# Altium schematic sheet AD_0.SchDoc
size A2; Date: Date; CompanyName: HESSO; Engineer: Name; Address1: Route du Rawyl 47; Address2: 1950 Sion; Address3: Switzerland; DocumentNumber: 5; SheetNumber: 5; SheetTotal: 8; ProjectName: Project Name
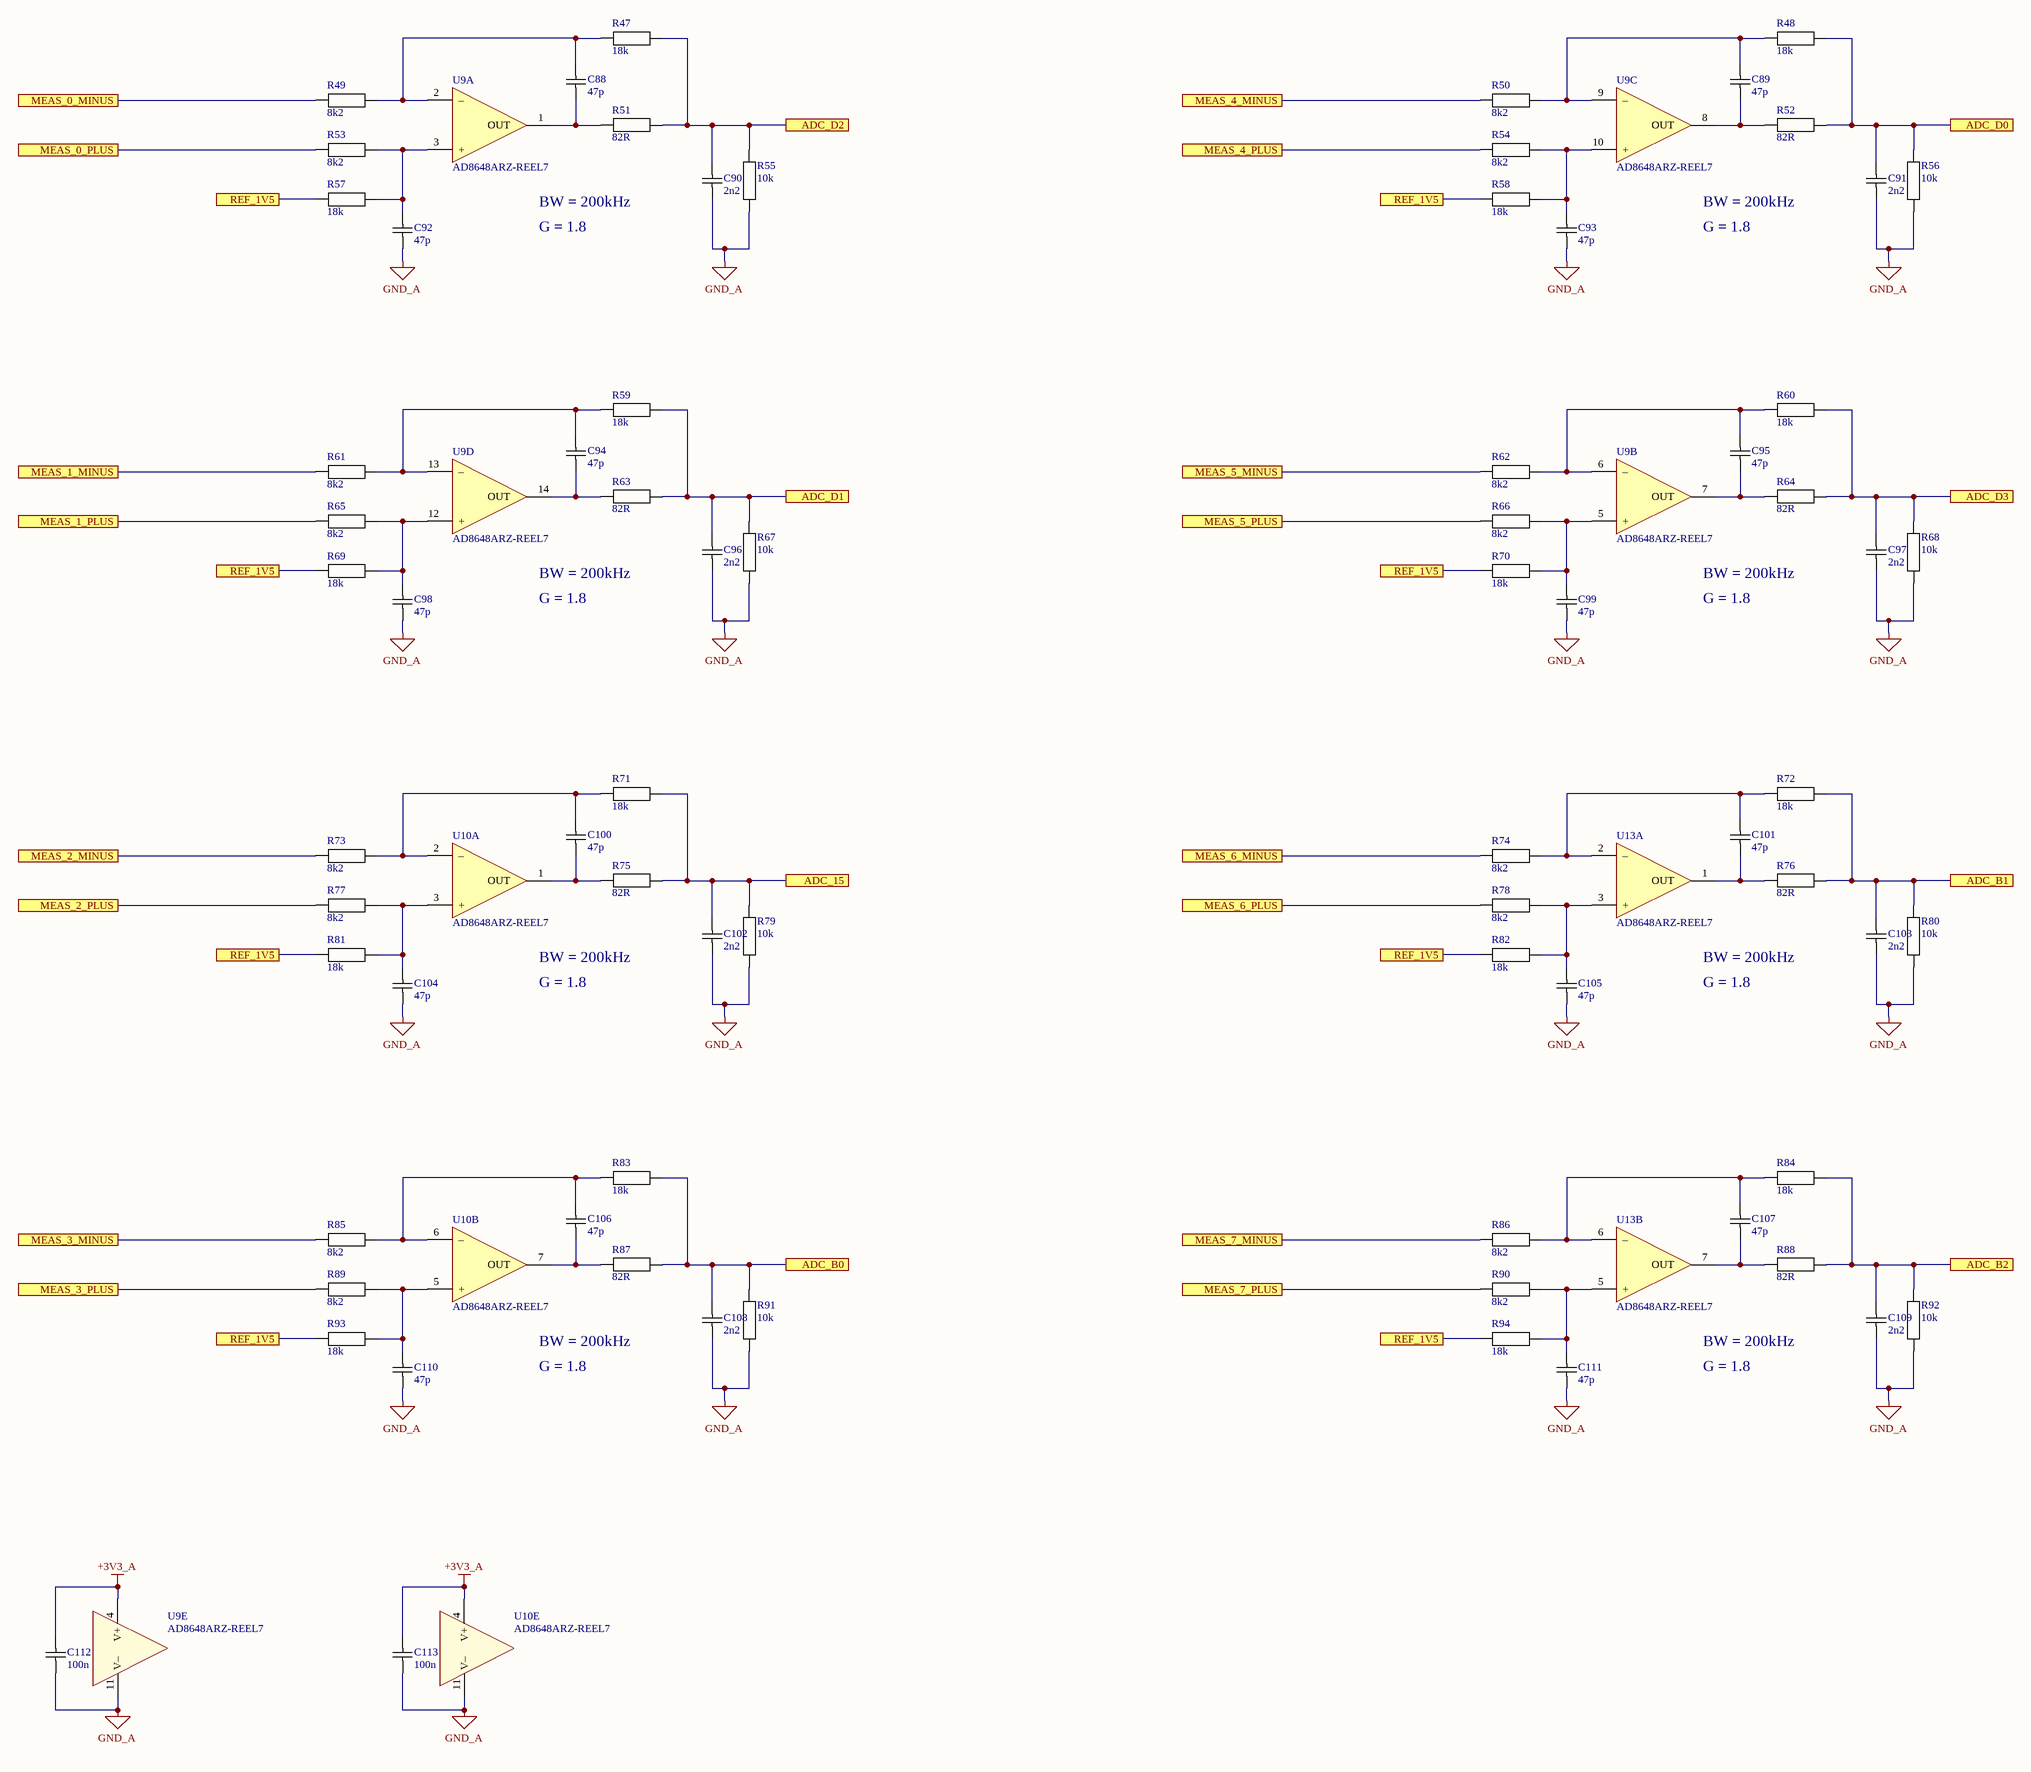
[diagram p0: AD_0.SchDoc]

## Parts
C88  47p  [CAPACITOR 1608 REFLOW]
C89  47p  [CAPACITOR 1608 REFLOW]
C90  2n2  [CAPACITOR 1608 REFLOW]
C91  2n2  [CAPACITOR 1608 REFLOW]
C92  47p  [CAPACITOR 1608 REFLOW]
C93  47p  [CAPACITOR 1608 REFLOW]
C94  47p  [CAPACITOR 1608 REFLOW]
C95  47p  [CAPACITOR 1608 REFLOW]
C96  2n2  [CAPACITOR 1608 REFLOW]
C97  2n2  [CAPACITOR 1608 REFLOW]
C98  47p  [CAPACITOR 1608 REFLOW]
C99  47p  [CAPACITOR 1608 REFLOW]
C100  47p  [CAPACITOR 1608 REFLOW]
C101  47p  [CAPACITOR 1608 REFLOW]
C102  2n2  [CAPACITOR 1608 REFLOW]
C103  2n2  [CAPACITOR 1608 REFLOW]
C104  47p  [CAPACITOR 1608 REFLOW]
C105  47p  [CAPACITOR 1608 REFLOW]
C106  47p  [CAPACITOR 1608 REFLOW]
C107  47p  [CAPACITOR 1608 REFLOW]
C108  2n2  [CAPACITOR 1608 REFLOW]
C109  2n2  [CAPACITOR 1608 REFLOW]
C110  47p  [CAPACITOR 1608 REFLOW]
C111  47p  [CAPACITOR 1608 REFLOW]
C112  100n  [CAPACITOR 1608 REFLOW]
C113  100n  [CAPACITOR 1608 REFLOW]
R47  18k  [RESISTOR 1608 REFLOW]
R48  18k  [RESISTOR 1608 REFLOW]
R49  8k2  [RESISTOR 1608 REFLOW]
R50  8k2  [RESISTOR 1608 REFLOW]
R51  82R  [RESISTOR 1608 REFLOW]
R52  82R  [RESISTOR 1608 REFLOW]
R53  8k2  [RESISTOR 1608 REFLOW]
R54  8k2  [RESISTOR 1608 REFLOW]
R55  10k  [RESISTOR 1608 REFLOW]
R56  10k  [RESISTOR 1608 REFLOW]
R57  18k  [RESISTOR 1608 REFLOW]
R58  18k  [RESISTOR 1608 REFLOW]
R59  18k  [RESISTOR 1608 REFLOW]
R60  18k  [RESISTOR 1608 REFLOW]
R61  8k2  [RESISTOR 1608 REFLOW]
R62  8k2  [RESISTOR 1608 REFLOW]
R63  82R  [RESISTOR 1608 REFLOW]
R64  82R  [RESISTOR 1608 REFLOW]
R65  8k2  [RESISTOR 1608 REFLOW]
R66  8k2  [RESISTOR 1608 REFLOW]
R67  10k  [RESISTOR 1608 REFLOW]
R68  10k  [RESISTOR 1608 REFLOW]
R69  18k  [RESISTOR 1608 REFLOW]
R70  18k  [RESISTOR 1608 REFLOW]
R71  18k  [RESISTOR 1608 REFLOW]
R72  18k  [RESISTOR 1608 REFLOW]
R73  8k2  [RESISTOR 1608 REFLOW]
R74  8k2  [RESISTOR 1608 REFLOW]
R75  82R  [RESISTOR 1608 REFLOW]
R76  82R  [RESISTOR 1608 REFLOW]
R77  8k2  [RESISTOR 1608 REFLOW]
R78  8k2  [RESISTOR 1608 REFLOW]
R79  10k  [RESISTOR 1608 REFLOW]
R80  10k  [RESISTOR 1608 REFLOW]
R81  18k  [RESISTOR 1608 REFLOW]
R82  18k  [RESISTOR 1608 REFLOW]
R83  18k  [RESISTOR 1608 REFLOW]
R84  18k  [RESISTOR 1608 REFLOW]
R85  8k2  [RESISTOR 1608 REFLOW]
R86  8k2  [RESISTOR 1608 REFLOW]
R87  82R  [RESISTOR 1608 REFLOW]
R88  82R  [RESISTOR 1608 REFLOW]
R89  8k2  [RESISTOR 1608 REFLOW]
R90  8k2  [RESISTOR 1608 REFLOW]
R91  10k  [RESISTOR 1608 REFLOW]
R92  10k  [RESISTOR 1608 REFLOW]
R93  18k  [RESISTOR 1608 REFLOW]
R94  18k  [RESISTOR 1608 REFLOW]
U9  AD8648ARZ-REEL7  [SO14 P1.27 C4.0X8.8 H1.75]  (parts A,B,C,D,E of 5)
U10  AD8648ARZ-REEL7  [SO14 P1.27 C4.0X8.8 H1.75]  (parts A,B,E of 5)
U13  AD8648ARZ-REEL7  [SO14 P1.27 C4.0X8.8 H1.75]  (parts A,B of 5)

## Ports
ADC_15, ADC_B0, ADC_B1, ADC_B2, ADC_D0, ADC_D1, ADC_D2, ADC_D3, MEAS_0_MINUS, MEAS_0_PLUS, MEAS_1_MINUS, MEAS_1_PLUS, MEAS_2_MINUS, MEAS_2_PLUS, MEAS_3_MINUS, MEAS_3_PLUS, MEAS_4_MINUS, MEAS_4_PLUS, MEAS_5_MINUS, MEAS_5_PLUS, MEAS_6_MINUS, MEAS_6_PLUS, MEAS_7_MINUS, MEAS_7_PLUS, REF_1V5

## Nets
+3V3_A: C112.2 C113.2 U9.4(V+) U10.4(V+)
GND_A: C90.1 C91.1 C92.1 C93.1 C96.1 C97.1 C98.1 C99.1 C102.1 C103.1 C104.1 C105.1 C108.1 C109.1 C110.1 C111.1 C112.1 C113.1 R55.2 R56.2 R67.2 R68.2 R79.2 R80.2 R91.2 R92.2 U9.11(V–) U10.11(V–)
ADC_15: C102.2 R71.2 R75.2 R79.1 ; port ADC_15
ADC_B0: C108.2 R83.2 R87.2 R91.1 ; port ADC_B0
ADC_B1: C103.2 R72.2 R76.2 R80.1 ; port ADC_B1
ADC_B2: C109.2 R84.2 R88.2 R92.1 ; port ADC_B2
ADC_D0: C91.2 R48.2 R52.2 R56.1 ; port ADC_D0
ADC_D1: C96.2 R59.2 R63.2 R67.1 ; port ADC_D1
ADC_D2: C90.2 R47.2 R51.2 R55.1 ; port ADC_D2
ADC_D3: C97.2 R60.2 R64.2 R68.1 ; port ADC_D3
MEAS_0_MINUS: R49.1 ; port MEAS_0_MINUS
MEAS_0_PLUS: R53.1 ; port MEAS_0_PLUS
MEAS_1_MINUS: R61.1 ; port MEAS_1_MINUS
MEAS_1_PLUS: R65.1 ; port MEAS_1_PLUS
MEAS_2_MINUS: R73.1 ; port MEAS_2_MINUS
MEAS_2_PLUS: R77.1 ; port MEAS_2_PLUS
MEAS_3_MINUS: R85.1 ; port MEAS_3_MINUS
MEAS_3_PLUS: R89.1 ; port MEAS_3_PLUS
MEAS_4_MINUS: R50.1 ; port MEAS_4_MINUS
MEAS_4_PLUS: R54.1 ; port MEAS_4_PLUS
MEAS_5_MINUS: R62.1 ; port MEAS_5_MINUS
MEAS_5_PLUS: R66.1 ; port MEAS_5_PLUS
MEAS_6_MINUS: R74.1 ; port MEAS_6_MINUS
MEAS_6_PLUS: R78.1 ; port MEAS_6_PLUS
MEAS_7_MINUS: R86.1 ; port MEAS_7_MINUS
MEAS_7_PLUS: R90.1 ; port MEAS_7_PLUS
REF_1V5: R57.2 R58.2 R69.2 R70.2 R81.2 R82.2 R93.2 R94.2 ; port REF_1V5
NetC88_1: C88.1 R51.1 U9.1(OUT)
NetC88_2: C88.2 R47.1 R49.2 U9.2(–)
NetC89_1: C89.1 R52.1 U9.8(OUT)
NetC89_2: C89.2 R48.1 R50.2 U9.9(–)
NetC92_2: C92.2 R53.2 R57.1 U9.3(+)
NetC93_2: C93.2 R54.2 R58.1 U9.10(+)
NetC94_1: C94.1 R63.1 U9.14(OUT)
NetC94_2: C94.2 R59.1 R61.2 U9.13(–)
NetC95_1: C95.1 R64.1 U9.7(OUT)
NetC95_2: C95.2 R60.1 R62.2 U9.6(–)
NetC98_2: C98.2 R65.2 R69.1 U9.12(+)
NetC99_2: C99.2 R66.2 R70.1 U9.5(+)
NetC100_1: C100.1 R75.1 U10.1(OUT)
NetC100_2: C100.2 R71.1 R73.2 U10.2(–)
NetC101_1: C101.1 R76.1 U13.1(OUT)
NetC101_2: C101.2 R72.1 R74.2 U13.2(–)
NetC104_2: C104.2 R77.2 R81.1 U10.3(+)
NetC105_2: C105.2 R78.2 R82.1 U13.3(+)
NetC106_1: C106.1 R87.1 U10.7(OUT)
NetC106_2: C106.2 R83.1 R85.2 U10.6(–)
NetC107_1: C107.1 R88.1 U13.7(OUT)
NetC107_2: C107.2 R84.1 R86.2 U13.6(–)
NetC110_2: C110.2 R89.2 R93.1 U10.5(+)
NetC111_2: C111.2 R90.2 R94.1 U13.5(+)

## Notes on the sheet
- BW = 200kHz
- G = 1.8
- Date :
- Revision :
- Sheet
- of
- Design by :

## Library data of the parts
C88-C113 = Capacitor: Capacitor X7R 10% 50V 1608(0603)
  C88 C89 C92-C95 C98-C101 C104-C107 C110 C111: Value: 47p
  C90 C91 C96 C97 C102 C103 C108 C109: Value: 2n2
  C112 C113: Value: 100n
R47-R94 = Resistor: Resistor 1% 50V 100mW 1608(0603)
  R47 R48 R57-R60 R69-R72 R81-R84 R93 R94: Value: 18k
  R49 R50 R53 R54 R61 R62 R65 R66 R73 R74 R77 R78 R85 R86 R89 R90: Value: 8k2
  R51 R52 R63 R64 R75 R76 R87 R88: Value: 82R
  R55 R56 R67 R68 R79 R80 R91 R92: Value: 10k
U9 U10 U13 = OPA QUAD: Generic quad OPA 14 pins; Manufacturer: Analog Devices; Value: AD8648ARZ-REEL7; Mouser No.: 584-AD8648ARZ-R7